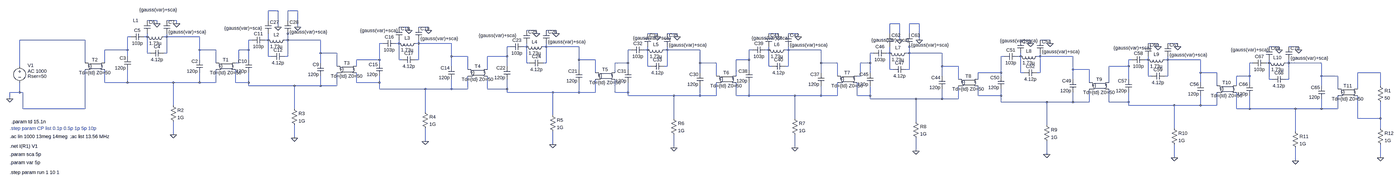
[diagram p0: schematic LTL_cp.asc, whole sheet]
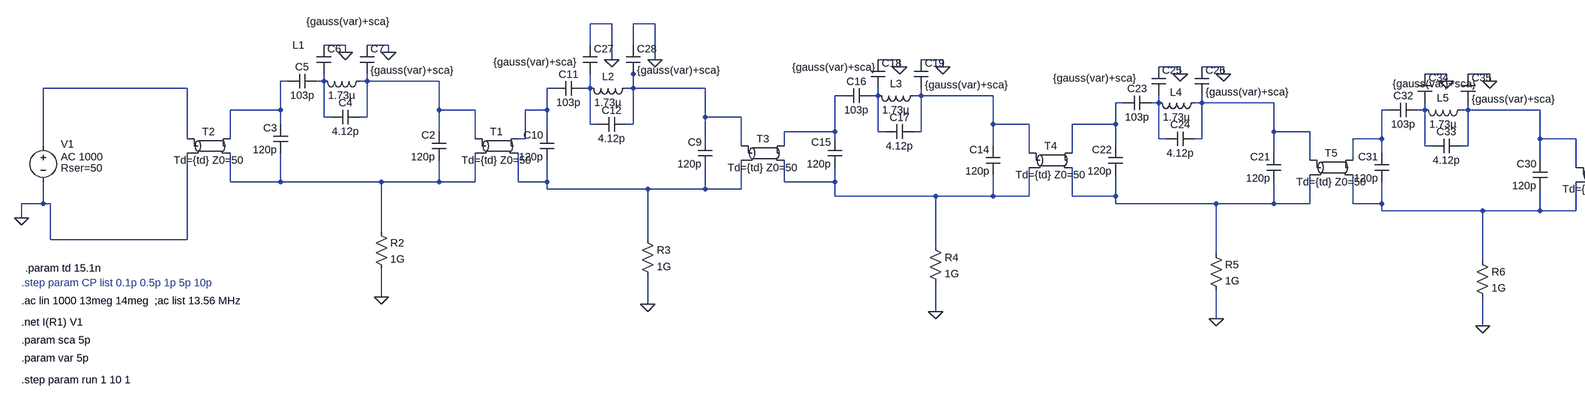
[diagram p1: schematic LTL_cp.asc, part, row 1 of 1, column 1 of 2]
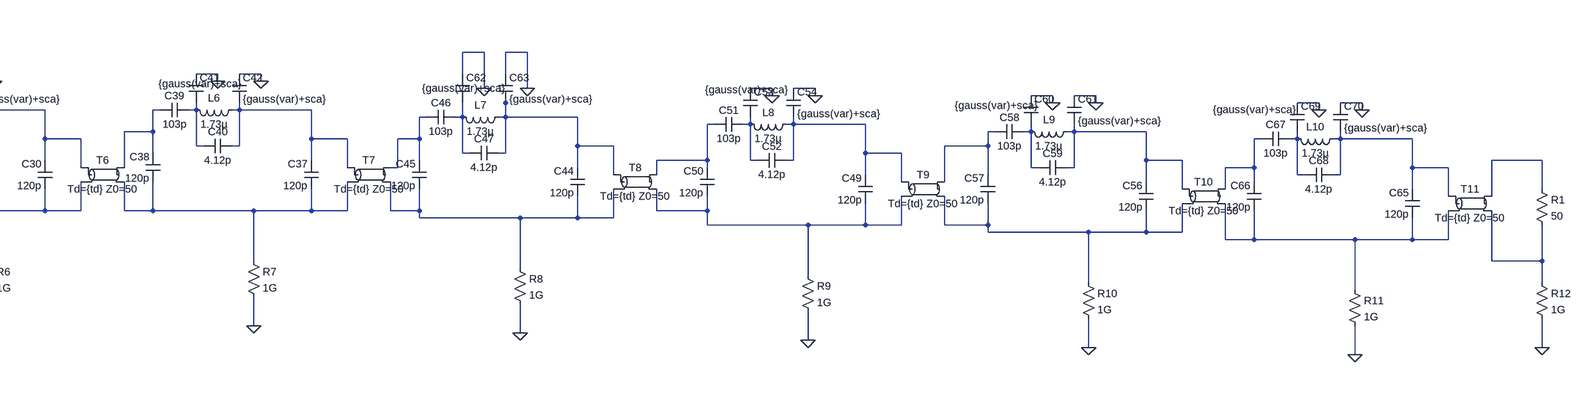
[diagram p2: schematic LTL_cp.asc, part, row 1 of 1, column 2 of 2]
LTL_cp.asc, the LTspice schematic file:
Version 4
SHEET 1 1680 680
WIRE -8496 -432 -8544 -432
WIRE -8400 -432 -8448 -432
WIRE -9088 -384 -9136 -384
WIRE -8992 -384 -9040 -384
WIRE -8544 -384 -8544 -432
WIRE -8448 -384 -8448 -432
WIRE -9088 -368 -9088 -384
WIRE -8992 -368 -8992 -384
WIRE -5456 -368 -5504 -368
WIRE -5360 -368 -5408 -368
WIRE -8496 -352 -8496 -432
WIRE -8400 -352 -8400 -432
WIRE -7856 -352 -7904 -352
WIRE -7760 -352 -7808 -352
WIRE -7856 -336 -7856 -352
WIRE -7760 -336 -7760 -352
WIRE -7232 -336 -7280 -336
WIRE -7136 -336 -7184 -336
WIRE -8448 -320 -8448 -336
WIRE -7232 -320 -7232 -336
WIRE -7136 -320 -7136 -336
WIRE -6640 -320 -6688 -320
WIRE -6544 -320 -6592 -320
WIRE -6048 -320 -6096 -320
WIRE -5952 -320 -6000 -320
WIRE -5504 -320 -5504 -368
WIRE -5408 -320 -5408 -368
WIRE -9216 -304 -9232 -304
WIRE -9136 -304 -9136 -320
WIRE -9136 -304 -9152 -304
WIRE -9040 -304 -9040 -320
WIRE -9040 -304 -9056 -304
WIRE -8880 -304 -9040 -304
WIRE -6640 -304 -6640 -320
WIRE -6544 -304 -6544 -320
WIRE -6048 -304 -6048 -320
WIRE -5952 -304 -5952 -320
WIRE -9440 -288 -9760 -288
WIRE -8624 -288 -8640 -288
WIRE -8544 -288 -8544 -320
WIRE -8544 -288 -8560 -288
WIRE -8448 -288 -8448 -320
WIRE -8448 -288 -8464 -288
WIRE -8288 -288 -8448 -288
WIRE -5456 -288 -5456 -368
WIRE -5360 -288 -5360 -368
WIRE -4816 -288 -4864 -288
WIRE -4720 -288 -4768 -288
WIRE -7984 -272 -8000 -272
WIRE -7904 -272 -7904 -288
WIRE -7904 -272 -7920 -272
WIRE -7808 -272 -7808 -288
WIRE -7808 -272 -7824 -272
WIRE -7648 -272 -7808 -272
WIRE -4816 -272 -4816 -288
WIRE -4720 -272 -4720 -288
WIRE -4192 -272 -4240 -272
WIRE -4096 -272 -4144 -272
WIRE -7360 -256 -7376 -256
WIRE -7280 -256 -7280 -272
WIRE -7280 -256 -7296 -256
WIRE -7184 -256 -7184 -272
WIRE -7184 -256 -7200 -256
WIRE -7024 -256 -7184 -256
WIRE -5408 -256 -5408 -272
WIRE -4192 -256 -4192 -272
WIRE -4096 -256 -4096 -272
WIRE -3600 -256 -3648 -256
WIRE -3504 -256 -3552 -256
WIRE -9232 -240 -9232 -304
WIRE -9232 -240 -9344 -240
WIRE -8880 -240 -8880 -304
WIRE -8800 -240 -8880 -240
WIRE -8640 -240 -8640 -288
WIRE -8640 -240 -8688 -240
WIRE -6768 -240 -6784 -240
WIRE -6688 -240 -6688 -256
WIRE -6688 -240 -6704 -240
WIRE -6592 -240 -6592 -256
WIRE -6592 -240 -6608 -240
WIRE -6432 -240 -6592 -240
WIRE -6176 -240 -6192 -240
WIRE -6096 -240 -6096 -256
WIRE -6096 -240 -6112 -240
WIRE -6000 -240 -6000 -256
WIRE -6000 -240 -6016 -240
WIRE -5840 -240 -6000 -240
WIRE -3600 -240 -3600 -256
WIRE -3504 -240 -3504 -256
WIRE -9136 -224 -9136 -304
WIRE -9120 -224 -9136 -224
WIRE -9040 -224 -9040 -304
WIRE -9040 -224 -9056 -224
WIRE -8288 -224 -8288 -288
WIRE -8208 -224 -8288 -224
WIRE -5584 -224 -5600 -224
WIRE -5504 -224 -5504 -256
WIRE -5504 -224 -5520 -224
WIRE -5408 -224 -5408 -256
WIRE -5408 -224 -5424 -224
WIRE -5248 -224 -5408 -224
WIRE -9232 -208 -9232 -240
WIRE -8544 -208 -8544 -288
WIRE -8528 -208 -8544 -208
WIRE -8448 -208 -8448 -288
WIRE -8448 -208 -8464 -208
WIRE -7648 -208 -7648 -272
WIRE -7568 -208 -7648 -208
WIRE -7376 -208 -7376 -256
WIRE -7376 -208 -7472 -208
WIRE -4944 -208 -4960 -208
WIRE -4864 -208 -4864 -224
WIRE -4864 -208 -4880 -208
WIRE -4768 -208 -4768 -224
WIRE -4768 -208 -4784 -208
WIRE -4608 -208 -4768 -208
WIRE -8880 -192 -8880 -240
WIRE -8640 -192 -8640 -240
WIRE -8000 -192 -8000 -272
WIRE -8000 -192 -8112 -192
WIRE -7904 -192 -7904 -272
WIRE -7888 -192 -7904 -192
WIRE -7808 -192 -7808 -272
WIRE -7808 -192 -7824 -192
WIRE -7024 -192 -7024 -256
WIRE -6944 -192 -7024 -192
WIRE -6192 -192 -6192 -240
WIRE -6192 -192 -6256 -192
WIRE -4320 -192 -4336 -192
WIRE -4240 -192 -4240 -208
WIRE -4240 -192 -4256 -192
WIRE -4144 -192 -4144 -208
WIRE -4144 -192 -4160 -192
WIRE -3984 -192 -4144 -192
WIRE -9440 -176 -9440 -288
WIRE -9344 -176 -9344 -240
WIRE -8800 -176 -8800 -240
WIRE -8688 -176 -8688 -240
WIRE -8688 -176 -8704 -176
WIRE -8288 -176 -8288 -224
WIRE -8000 -176 -8000 -192
WIRE -7280 -176 -7280 -256
WIRE -7264 -176 -7280 -176
WIRE -7184 -176 -7184 -256
WIRE -7184 -176 -7200 -176
WIRE -6784 -176 -6784 -240
WIRE -6784 -176 -6848 -176
WIRE -6432 -176 -6432 -240
WIRE -6352 -176 -6432 -176
WIRE -5840 -176 -5840 -240
WIRE -5760 -176 -5840 -176
WIRE -5600 -176 -5600 -224
WIRE -5600 -176 -5648 -176
WIRE -3728 -176 -3744 -176
WIRE -3648 -176 -3648 -192
WIRE -3648 -176 -3664 -176
WIRE -3552 -176 -3552 -192
WIRE -3552 -176 -3568 -176
WIRE -3392 -176 -3552 -176
WIRE -9760 -160 -9760 -288
WIRE -8208 -160 -8208 -224
WIRE -8112 -160 -8112 -192
WIRE -7648 -160 -7648 -208
WIRE -7376 -160 -7376 -208
WIRE -6688 -160 -6688 -240
WIRE -6672 -160 -6688 -160
WIRE -6592 -160 -6592 -240
WIRE -6592 -160 -6608 -160
WIRE -6096 -160 -6096 -240
WIRE -6080 -160 -6096 -160
WIRE -6000 -160 -6000 -240
WIRE -6000 -160 -6016 -160
WIRE -5248 -160 -5248 -224
WIRE -5168 -160 -5248 -160
WIRE -4336 -160 -4336 -192
WIRE -4336 -160 -4432 -160
WIRE -7568 -144 -7568 -208
WIRE -7472 -144 -7472 -208
WIRE -7024 -144 -7024 -192
WIRE -6784 -144 -6784 -176
WIRE -6192 -144 -6192 -192
WIRE -5504 -144 -5504 -224
WIRE -5488 -144 -5504 -144
WIRE -5408 -144 -5408 -224
WIRE -5408 -144 -5424 -144
WIRE -4608 -144 -4608 -208
WIRE -4528 -144 -4608 -144
WIRE -6944 -128 -6944 -192
WIRE -6848 -128 -6848 -176
WIRE -6432 -128 -6432 -176
WIRE -5840 -128 -5840 -176
WIRE -5600 -128 -5600 -176
WIRE -4960 -128 -4960 -208
WIRE -4960 -128 -5072 -128
WIRE -4864 -128 -4864 -208
WIRE -4848 -128 -4864 -128
WIRE -4768 -128 -4768 -208
WIRE -4768 -128 -4784 -128
WIRE -3984 -128 -3984 -192
WIRE -3904 -128 -3984 -128
WIRE -3104 -128 -3216 -128
WIRE -6352 -112 -6352 -176
WIRE -6256 -112 -6256 -192
WIRE -5760 -112 -5760 -176
WIRE -5648 -112 -5648 -176
WIRE -5648 -112 -5664 -112
WIRE -5248 -112 -5248 -160
WIRE -4960 -112 -4960 -128
WIRE -4240 -112 -4240 -192
WIRE -4224 -112 -4240 -112
WIRE -4144 -112 -4144 -192
WIRE -4144 -112 -4160 -112
WIRE -3744 -112 -3744 -176
WIRE -3744 -112 -3808 -112
WIRE -3392 -112 -3392 -176
WIRE -3312 -112 -3392 -112
WIRE -5168 -96 -5168 -160
WIRE -5072 -96 -5072 -128
WIRE -4608 -96 -4608 -144
WIRE -4336 -96 -4336 -160
WIRE -3648 -96 -3648 -176
WIRE -3632 -96 -3648 -96
WIRE -3552 -96 -3552 -176
WIRE -3552 -96 -3568 -96
WIRE -9344 -80 -9344 -144
WIRE -9232 -80 -9232 -144
WIRE -9232 -80 -9344 -80
WIRE -9008 -80 -9232 -80
WIRE -8880 -80 -8880 -128
WIRE -8880 -80 -9008 -80
WIRE -8800 -80 -8800 -144
WIRE -8800 -80 -8880 -80
WIRE -8704 -80 -8704 -144
WIRE -8640 -80 -8640 -128
WIRE -8640 -80 -8704 -80
WIRE -8112 -80 -8112 -128
WIRE -8000 -80 -8000 -112
WIRE -8000 -80 -8112 -80
WIRE -4528 -80 -4528 -144
WIRE -4432 -80 -4432 -160
WIRE -3984 -80 -3984 -128
WIRE -3744 -80 -3744 -112
WIRE -8640 -64 -8640 -80
WIRE -8416 -64 -8640 -64
WIRE -8288 -64 -8288 -112
WIRE -8288 -64 -8416 -64
WIRE -8208 -64 -8208 -128
WIRE -8208 -64 -8288 -64
WIRE -3904 -64 -3904 -128
WIRE -3808 -64 -3808 -112
WIRE -3392 -64 -3392 -112
WIRE -3104 -64 -3104 -128
WIRE -8000 -48 -8000 -80
WIRE -7776 -48 -8000 -48
WIRE -7648 -48 -7648 -96
WIRE -7648 -48 -7776 -48
WIRE -7568 -48 -7568 -112
WIRE -7568 -48 -7648 -48
WIRE -7472 -48 -7472 -112
WIRE -7376 -48 -7376 -96
WIRE -7376 -48 -7472 -48
WIRE -3312 -48 -3312 -112
WIRE -3216 -48 -3216 -128
WIRE -9760 -32 -9760 -80
WIRE -9760 -32 -9808 -32
WIRE -9744 -32 -9760 -32
WIRE -7376 -32 -7376 -48
WIRE -7152 -32 -7376 -32
WIRE -7024 -32 -7024 -80
WIRE -7024 -32 -7152 -32
WIRE -6944 -32 -6944 -96
WIRE -6944 -32 -7024 -32
WIRE -6848 -32 -6848 -96
WIRE -6784 -32 -6784 -80
WIRE -6784 -32 -6848 -32
WIRE -6784 -16 -6784 -32
WIRE -6560 -16 -6784 -16
WIRE -6432 -16 -6432 -64
WIRE -6432 -16 -6560 -16
WIRE -6352 -16 -6352 -80
WIRE -6352 -16 -6432 -16
WIRE -6256 -16 -6256 -80
WIRE -6192 -16 -6192 -80
WIRE -6192 -16 -6256 -16
WIRE -5968 -16 -6192 -16
WIRE -5840 -16 -5840 -64
WIRE -5840 -16 -5968 -16
WIRE -5760 -16 -5760 -80
WIRE -5760 -16 -5840 -16
WIRE -5664 -16 -5664 -80
WIRE -5600 -16 -5600 -64
WIRE -5600 -16 -5664 -16
WIRE -5072 -16 -5072 -64
WIRE -4960 -16 -4960 -48
WIRE -4960 -16 -5072 -16
WIRE -9808 0 -9808 -32
WIRE -5600 0 -5600 -16
WIRE -5376 0 -5600 0
WIRE -5248 0 -5248 -48
WIRE -5248 0 -5376 0
WIRE -5168 0 -5168 -64
WIRE -5168 0 -5248 0
WIRE -4960 16 -4960 -16
WIRE -4736 16 -4960 16
WIRE -4608 16 -4608 -32
WIRE -4608 16 -4736 16
WIRE -4528 16 -4528 -48
WIRE -4528 16 -4608 16
WIRE -4432 16 -4432 -48
WIRE -4336 16 -4336 -32
WIRE -4336 16 -4432 16
WIRE -9008 32 -9008 -80
WIRE -4336 32 -4336 16
WIRE -4112 32 -4336 32
WIRE -3984 32 -3984 -16
WIRE -3984 32 -4112 32
WIRE -3904 32 -3904 -32
WIRE -3904 32 -3984 32
WIRE -9744 48 -9744 -32
WIRE -9440 48 -9440 -144
WIRE -9440 48 -9744 48
WIRE -8416 48 -8416 -64
WIRE -3808 48 -3808 -32
WIRE -3744 48 -3744 -16
WIRE -3744 48 -3808 48
WIRE -3520 48 -3744 48
WIRE -3392 48 -3392 0
WIRE -3392 48 -3520 48
WIRE -3312 48 -3312 -16
WIRE -3312 48 -3392 48
WIRE -7776 64 -7776 -48
WIRE -7152 80 -7152 -32
WIRE -6560 96 -6560 -16
WIRE -5968 96 -5968 -16
WIRE -3216 96 -3216 -16
WIRE -3104 96 -3104 16
WIRE -3104 96 -3216 96
WIRE -5376 112 -5376 0
WIRE -4736 128 -4736 16
WIRE -4112 144 -4112 32
WIRE -3104 144 -3104 96
WIRE -3520 160 -3520 48
WIRE -9008 176 -9008 112
WIRE -8416 192 -8416 128
WIRE -7776 208 -7776 144
WIRE -7152 224 -7152 160
WIRE -6560 240 -6560 176
WIRE -5968 240 -5968 176
WIRE -5376 256 -5376 192
WIRE -4736 272 -4736 208
WIRE -4112 288 -4112 224
WIRE -3104 288 -3104 224
WIRE -3520 304 -3520 240
FLAG -9808 0 0
FLAG -9008 176 0
FLAG -9088 -368 0
FLAG -8992 -368 0
FLAG -8416 192 0
FLAG -8496 -352 0
FLAG -8400 -352 0
FLAG -7776 208 0
FLAG -7856 -336 0
FLAG -7760 -336 0
FLAG -7152 224 0
FLAG -7232 -320 0
FLAG -7136 -320 0
FLAG -6560 240 0
FLAG -6640 -304 0
FLAG -6544 -304 0
FLAG -5968 240 0
FLAG -6048 -304 0
FLAG -5952 -304 0
FLAG -5376 256 0
FLAG -5456 -288 0
FLAG -5360 -288 0
FLAG -4736 272 0
FLAG -4816 -272 0
FLAG -4720 -272 0
FLAG -4112 288 0
FLAG -4192 -256 0
FLAG -4096 -256 0
FLAG -3520 304 0
FLAG -3600 -240 0
FLAG -3504 -240 0
FLAG -3104 288 0
SYMBOL voltage -9760 -176 R0
WINDOW 0 39 12 Left 2
WINDOW 123 39 40 Left 2
WINDOW 39 39 65 Left 2
SYMATTR InstName V1
SYMATTR Value2 AC 1000
SYMATTR SpiceLine Rser=50
SYMATTR Value ""
SYMBOL res -3120 -80 R0
SYMATTR InstName R1
SYMATTR Value 50
SYMBOL tline -8752 -160 R0
SYMATTR InstName T1
SYMATTR Value Td={td} Z0=50
SYMBOL tline -9392 -160 R0
SYMATTR InstName T2
SYMATTR Value Td={td} Z0=50
SYMBOL cap -8864 -128 R180
WINDOW 0 24 56 Left 2
WINDOW 3 24 8 Left 2
SYMATTR InstName C2
SYMATTR Value 120p
SYMBOL cap -9216 -144 R180
WINDOW 0 24 56 Left 2
WINDOW 3 24 8 Left 2
SYMATTR InstName C3
SYMATTR Value 120p
SYMBOL res -9024 16 R0
SYMATTR InstName R2
SYMATTR Value 1G
SYMBOL ind -9040 -320 R90
WINDOW 0 -49 152 VBottom 2
WINDOW 3 32 56 VTop 2
SYMATTR InstName L1
SYMATTR Value 1.73µ
SYMBOL cap -9152 -320 R90
WINDOW 0 0 32 VBottom 2
WINDOW 3 32 32 VTop 2
SYMATTR InstName C5
SYMATTR Value 103p
SYMBOL cap -9056 -240 R90
WINDOW 0 0 32 VBottom 2
WINDOW 3 32 32 VTop 2
SYMATTR InstName C4
SYMATTR Value 4.12p
SYMBOL cap -9152 -384 R0
WINDOW 3 -23 -53 Left 2
SYMATTR Value {gauss(var)+sca}
SYMATTR InstName C6
SYMBOL cap -9056 -384 R0
SYMATTR InstName C7
SYMATTR Value {gauss(var)+sca}
SYMBOL tline -8160 -144 R0
SYMATTR InstName T3
SYMATTR Value Td={td} Z0=50
SYMBOL cap -8272 -112 R180
WINDOW 0 24 56 Left 2
WINDOW 3 24 8 Left 2
SYMATTR InstName C9
SYMATTR Value 120p
SYMBOL cap -8624 -128 R180
WINDOW 0 24 56 Left 2
WINDOW 3 24 8 Left 2
SYMATTR InstName C10
SYMATTR Value 120p
SYMBOL res -8432 32 R0
SYMATTR InstName R3
SYMATTR Value 1G
SYMBOL ind -8448 -304 R90
WINDOW 0 5 56 VBottom 2
WINDOW 3 32 56 VTop 2
SYMATTR InstName L2
SYMATTR Value 1.73µ
SYMBOL cap -8560 -304 R90
WINDOW 0 0 32 VBottom 2
WINDOW 3 32 32 VTop 2
SYMATTR InstName C11
SYMATTR Value 103p
SYMBOL cap -8464 -224 R90
WINDOW 0 0 32 VBottom 2
WINDOW 3 32 32 VTop 2
SYMATTR InstName C12
SYMATTR Value 4.12p
SYMBOL tline -7520 -128 R0
SYMATTR InstName T4
SYMATTR Value Td={td} Z0=50
SYMBOL cap -7632 -96 R180
WINDOW 0 24 56 Left 2
WINDOW 3 24 8 Left 2
SYMATTR InstName C14
SYMATTR Value 120p
SYMBOL cap -7984 -112 R180
WINDOW 0 24 56 Left 2
WINDOW 3 24 8 Left 2
SYMATTR InstName C15
SYMATTR Value 120p
SYMBOL res -7792 48 R0
SYMATTR InstName R4
SYMATTR Value 1G
SYMBOL ind -7808 -288 R90
WINDOW 0 5 56 VBottom 2
WINDOW 3 32 56 VTop 2
SYMATTR InstName L3
SYMATTR Value 1.73µ
SYMBOL cap -7920 -288 R90
WINDOW 0 0 32 VBottom 2
WINDOW 3 32 32 VTop 2
SYMATTR InstName C16
SYMATTR Value 103p
SYMBOL cap -7824 -208 R90
WINDOW 0 0 32 VBottom 2
WINDOW 3 32 32 VTop 2
SYMATTR InstName C17
SYMATTR Value 4.12p
SYMBOL cap -7920 -352 R0
WINDOW 3 -175 17 Left 2
SYMATTR Value {gauss(var)+sca}
SYMATTR InstName C18
SYMBOL cap -7824 -352 R0
SYMATTR InstName C19
SYMATTR Value {gauss(var)+sca}
SYMBOL tline -6896 -112 R0
SYMATTR InstName T5
SYMATTR Value Td={td} Z0=50
SYMBOL cap -7008 -80 R180
WINDOW 0 24 56 Left 2
WINDOW 3 24 8 Left 2
SYMATTR InstName C21
SYMATTR Value 120p
SYMBOL cap -7360 -96 R180
WINDOW 0 24 56 Left 2
WINDOW 3 24 8 Left 2
SYMATTR InstName C22
SYMATTR Value 120p
SYMBOL res -7168 64 R0
SYMATTR InstName R5
SYMATTR Value 1G
SYMBOL ind -7184 -272 R90
WINDOW 0 8 57 VBottom 2
WINDOW 3 32 56 VTop 2
SYMATTR InstName L4
SYMATTR Value 1.73µ
SYMBOL cap -7296 -272 R90
WINDOW 0 0 32 VBottom 2
WINDOW 3 32 32 VTop 2
SYMATTR InstName C23
SYMATTR Value 103p
SYMBOL cap -7200 -192 R90
WINDOW 0 0 32 VBottom 2
WINDOW 3 32 32 VTop 2
SYMATTR InstName C24
SYMATTR Value 4.12p
SYMBOL cap -7296 -336 R0
WINDOW 3 -219 25 Left 2
SYMATTR Value {gauss(var)+sca}
SYMATTR InstName C25
SYMBOL cap -7200 -336 R0
SYMATTR InstName C26
SYMATTR Value {gauss(var)+sca}
SYMBOL cap -8560 -384 R0
WINDOW 3 -199 37 Left 2
SYMATTR Value {gauss(var)+sca}
SYMATTR InstName C27
SYMBOL cap -8464 -384 R0
SYMATTR InstName C28
SYMATTR Value {gauss(var)+sca}
SYMBOL tline -6304 -96 R0
SYMATTR InstName T6
SYMATTR Value Td={td} Z0=50
SYMBOL cap -6416 -64 R180
WINDOW 0 24 56 Left 2
WINDOW 3 24 8 Left 2
SYMATTR InstName C30
SYMATTR Value 120p
SYMBOL cap -6768 -80 R180
WINDOW 0 24 56 Left 2
WINDOW 3 24 8 Left 2
SYMATTR InstName C31
SYMATTR Value 120p
SYMBOL res -6576 80 R0
SYMATTR InstName R6
SYMATTR Value 1G
SYMBOL ind -6592 -256 R90
WINDOW 0 5 56 VBottom 2
WINDOW 3 32 56 VTop 2
SYMATTR InstName L5
SYMATTR Value 1.73µ
SYMBOL cap -6704 -256 R90
WINDOW 0 0 32 VBottom 2
WINDOW 3 32 32 VTop 2
SYMATTR InstName C32
SYMATTR Value 103p
SYMBOL cap -6608 -176 R90
WINDOW 0 0 32 VBottom 2
WINDOW 3 32 32 VTop 2
SYMATTR InstName C33
SYMATTR Value 4.12p
SYMBOL cap -6704 -320 R0
WINDOW 3 -56 22 Left 2
SYMATTR Value {gauss(var)+sca}
SYMATTR InstName C34
SYMBOL cap -6608 -320 R0
SYMATTR InstName C35
SYMATTR Value {gauss(var)+sca}
SYMBOL tline -5712 -96 R0
SYMATTR InstName T7
SYMATTR Value Td={td} Z0=50
SYMBOL cap -5824 -64 R180
WINDOW 0 24 56 Left 2
WINDOW 3 24 8 Left 2
SYMATTR InstName C37
SYMATTR Value 120p
SYMBOL cap -6176 -80 R180
WINDOW 0 24 56 Left 2
WINDOW 3 24 8 Left 2
SYMATTR InstName C38
SYMATTR Value 120p
SYMBOL res -5984 80 R0
SYMATTR InstName R7
SYMATTR Value 1G
SYMBOL ind -6000 -256 R90
WINDOW 0 5 56 VBottom 2
WINDOW 3 32 56 VTop 2
SYMATTR InstName L6
SYMATTR Value 1.73µ
SYMBOL cap -6112 -256 R90
WINDOW 0 0 32 VBottom 2
WINDOW 3 32 32 VTop 2
SYMATTR InstName C39
SYMATTR Value 103p
SYMBOL cap -6016 -176 R90
WINDOW 0 0 32 VBottom 2
WINDOW 3 32 32 VTop 2
SYMATTR InstName C40
SYMATTR Value 4.12p
SYMBOL cap -6112 -320 R0
WINDOW 3 -68 22 Left 2
SYMATTR Value {gauss(var)+sca}
SYMATTR InstName C41
SYMBOL cap -6016 -320 R0
SYMATTR InstName C42
SYMATTR Value {gauss(var)+sca}
SYMBOL tline -5120 -80 R0
SYMATTR InstName T8
SYMATTR Value Td={td} Z0=50
SYMBOL cap -5232 -48 R180
WINDOW 0 24 56 Left 2
WINDOW 3 24 8 Left 2
SYMATTR InstName C44
SYMATTR Value 120p
SYMBOL cap -5584 -64 R180
WINDOW 0 24 56 Left 2
WINDOW 3 24 8 Left 2
SYMATTR InstName C45
SYMATTR Value 120p
SYMBOL res -5392 96 R0
SYMATTR InstName R8
SYMATTR Value 1G
SYMBOL ind -5408 -240 R90
WINDOW 0 5 56 VBottom 2
WINDOW 3 32 56 VTop 2
SYMATTR InstName L7
SYMATTR Value 1.73µ
SYMBOL cap -5520 -240 R90
WINDOW 0 0 32 VBottom 2
WINDOW 3 32 32 VTop 2
SYMATTR InstName C46
SYMATTR Value 103p
SYMBOL cap -5424 -160 R90
WINDOW 0 0 32 VBottom 2
WINDOW 3 32 32 VTop 2
SYMATTR InstName C47
SYMATTR Value 4.12p
SYMBOL tline -4480 -64 R0
SYMATTR InstName T9
SYMATTR Value Td={td} Z0=50
SYMBOL cap -4592 -32 R180
WINDOW 0 24 56 Left 2
WINDOW 3 24 8 Left 2
SYMATTR InstName C49
SYMATTR Value 120p
SYMBOL cap -4944 -48 R180
WINDOW 0 24 56 Left 2
WINDOW 3 24 8 Left 2
SYMATTR InstName C50
SYMATTR Value 120p
SYMBOL res -4752 112 R0
SYMATTR InstName R9
SYMATTR Value 1G
SYMBOL ind -4768 -224 R90
WINDOW 0 5 56 VBottom 2
WINDOW 3 32 56 VTop 2
SYMATTR InstName L8
SYMATTR Value 1.73µ
SYMBOL cap -4880 -224 R90
WINDOW 0 0 32 VBottom 2
WINDOW 3 32 32 VTop 2
SYMATTR InstName C51
SYMATTR Value 103p
SYMBOL cap -4784 -144 R90
WINDOW 0 0 32 VBottom 2
WINDOW 3 32 32 VTop 2
SYMATTR InstName C52
SYMATTR Value 4.12p
SYMBOL cap -4880 -288 R0
WINDOW 3 -85 3 Left 2
SYMATTR Value {gauss(var)+sca}
SYMATTR InstName C53
SYMBOL cap -4784 -288 R0
SYMATTR InstName C54
SYMATTR Value {gauss(var)+sca}
SYMBOL tline -3856 -48 R0
SYMATTR InstName T10
SYMATTR Value Td={td} Z0=50
SYMBOL cap -3968 -16 R180
WINDOW 0 24 56 Left 2
WINDOW 3 24 8 Left 2
SYMATTR InstName C56
SYMATTR Value 120p
SYMBOL cap -4320 -32 R180
WINDOW 0 24 56 Left 2
WINDOW 3 24 8 Left 2
SYMATTR InstName C57
SYMATTR Value 120p
SYMBOL res -4128 128 R0
SYMATTR InstName R10
SYMATTR Value 1G
SYMBOL ind -4144 -208 R90
WINDOW 0 5 56 VBottom 2
WINDOW 3 32 56 VTop 2
SYMATTR InstName L9
SYMATTR Value 1.73µ
SYMBOL cap -4256 -208 R90
WINDOW 0 0 32 VBottom 2
WINDOW 3 32 32 VTop 2
SYMATTR InstName C58
SYMATTR Value 103p
SYMBOL cap -4160 -128 R90
WINDOW 0 0 32 VBottom 2
WINDOW 3 32 32 VTop 2
SYMATTR InstName C59
SYMATTR Value 4.12p
SYMBOL cap -4256 -272 R0
WINDOW 3 -154 22 Left 2
SYMATTR Value {gauss(var)+sca}
SYMATTR InstName C60
SYMBOL cap -4160 -272 R0
SYMATTR InstName C61
SYMATTR Value {gauss(var)+sca}
SYMBOL cap -5520 -320 R0
WINDOW 3 -74 32 Left 2
SYMATTR Value {gauss(var)+sca}
SYMATTR InstName C62
SYMBOL cap -5424 -320 R0
SYMATTR InstName C63
SYMATTR Value {gauss(var)+sca}
SYMBOL tline -3264 -32 R0
SYMATTR InstName T11
SYMATTR Value Td={td} Z0=50
SYMBOL cap -3376 0 R180
WINDOW 0 24 56 Left 2
WINDOW 3 24 8 Left 2
SYMATTR InstName C65
SYMATTR Value 120p
SYMBOL cap -3728 -16 R180
WINDOW 0 24 56 Left 2
WINDOW 3 24 8 Left 2
SYMATTR InstName C66
SYMATTR Value 120p
SYMBOL res -3536 144 R0
SYMATTR InstName R11
SYMATTR Value 1G
SYMBOL ind -3552 -192 R90
WINDOW 0 5 56 VBottom 2
WINDOW 3 32 56 VTop 2
SYMATTR InstName L10
SYMATTR Value 1.73µ
SYMBOL cap -3664 -192 R90
WINDOW 0 0 32 VBottom 2
WINDOW 3 32 32 VTop 2
SYMATTR InstName C67
SYMATTR Value 103p
SYMBOL cap -3568 -112 R90
WINDOW 0 0 32 VBottom 2
WINDOW 3 32 32 VTop 2
SYMATTR InstName C68
SYMATTR Value 4.12p
SYMBOL cap -3664 -256 R0
WINDOW 3 -172 15 Left 2
SYMATTR Value {gauss(var)+sca}
SYMATTR InstName C69
SYMBOL cap -3568 -256 R0
SYMATTR InstName C70
SYMATTR Value {gauss(var)+sca}
SYMBOL res -3120 128 R0
SYMATTR InstName R12
SYMATTR Value 1G
TEXT -9808 184 Left 2 !.ac lin 1000 13meg 14meg
TEXT -9808 232 Left 2 !.net I(R1) V1
TEXT -9808 144 Left 2 ;.step param CP list 0.1p 0.5p 1p 5p 10p
TEXT -9800 112 Left 2 !.param td 15.1n
TEXT -9808 272 Left 2 !.param sca 5p
TEXT -9808 312 Left 2 !.param var 5p
TEXT -9808 360 Left 2 !.step param run 1 10 1
TEXT -9512 184 Left 2 !;ac list 13.56 MHz

The netlist it stands for:
* LTL_cp.asc
V1 N005 0 AC 1000 Rser=50
R1 N032 N043 50
T1 N004 N033 N006 N034 Td={td} Z0=50
T2 N005 0 N002 N033 Td={td} Z0=50
C2 N033 N004 120p
C3 N033 N002 120p
R2 N033 0 1G
L1 N004 N003 1.73µ
C5 N003 N002 103p
C4 N004 N003 4.12p
C6 0 N003 {gauss(var)+sca}
C7 0 N004 {gauss(var)+sca}
T3 N001 N034 N008 N035 Td={td} Z0=50
C9 N034 N001 120p
C10 N034 N006 120p
R3 N034 0 1G
L2 N001 N007 1.73µ
C11 N007 N006 103p
C12 N001 N007 4.12p
T4 N010 N035 N011 N036 Td={td} Z0=50
C14 N035 N010 120p
C15 N035 N008 120p
R4 N035 0 1G
L3 N010 N009 1.73µ
C16 N009 N008 103p
C17 N010 N009 4.12p
C18 0 N009 {gauss(var)+sca}
C19 0 N010 {gauss(var)+sca}
T5 N013 N036 N015 N037 Td={td} Z0=50
C21 N036 N013 120p
C22 N036 N011 120p
R5 N036 0 1G
L4 N013 N012 1.73µ
C23 N012 N011 103p
C24 N013 N012 4.12p
C25 0 N012 {gauss(var)+sca}
C26 0 N013 {gauss(var)+sca}
C27 0 N007 {gauss(var)+sca}
C28 0 N001 {gauss(var)+sca}
T6 N017 N037 N018 N038 Td={td} Z0=50
C30 N037 N017 120p
C31 N037 N015 120p
R6 N037 0 1G
L5 N017 N016 1.73µ
C32 N016 N015 103p
C33 N017 N016 4.12p
C34 0 N016 {gauss(var)+sca}
C35 0 N017 {gauss(var)+sca}
T7 N020 N038 N021 N039 Td={td} Z0=50
C37 N038 N020 120p
C38 N038 N018 120p
R7 N038 0 1G
L6 N020 N019 1.73µ
C39 N019 N018 103p
C40 N020 N019 4.12p
C41 0 N019 {gauss(var)+sca}
C42 0 N020 {gauss(var)+sca}
T8 N014 N039 N023 N040 Td={td} Z0=50
C44 N039 N014 120p
C45 N039 N021 120p
R8 N039 0 1G
L7 N014 N022 1.73µ
C46 N022 N021 103p
C47 N014 N022 4.12p
T9 N025 N040 N026 N041 Td={td} Z0=50
C49 N040 N025 120p
C50 N040 N023 120p
R9 N040 0 1G
L8 N025 N024 1.73µ
C51 N024 N023 103p
C52 N025 N024 4.12p
C53 0 N024 {gauss(var)+sca}
C54 0 N025 {gauss(var)+sca}
T10 N028 N041 N029 N042 Td={td} Z0=50
C56 N041 N028 120p
C57 N041 N026 120p
R10 N041 0 1G
L9 N028 N027 1.73µ
C58 N027 N026 103p
C59 N028 N027 4.12p
C60 0 N027 {gauss(var)+sca}
C61 0 N028 {gauss(var)+sca}
C62 0 N022 {gauss(var)+sca}
C63 0 N014 {gauss(var)+sca}
T11 N031 N042 N032 N043 Td={td} Z0=50
C65 N042 N031 120p
C66 N042 N029 120p
R11 N042 0 1G
L10 N031 N030 1.73µ
C67 N030 N029 103p
C68 N031 N030 4.12p
C69 0 N030 {gauss(var)+sca}
C70 0 N031 {gauss(var)+sca}
R12 N043 0 1G
.ac lin 1000 13meg 14meg
.net I(R1) V1
* .step param CP list 0.1p 0.5p 1p 5p 10p
.param td 15.1n
.param sca 5p
.param var 5p
.step param run 1 10 1
;ac list 13.56 MHz
.backanno
.end